# Altium schematic sheet BM_LTC2943.SchDoc
size A4; SheetNumber: 6; SheetTotal: 10
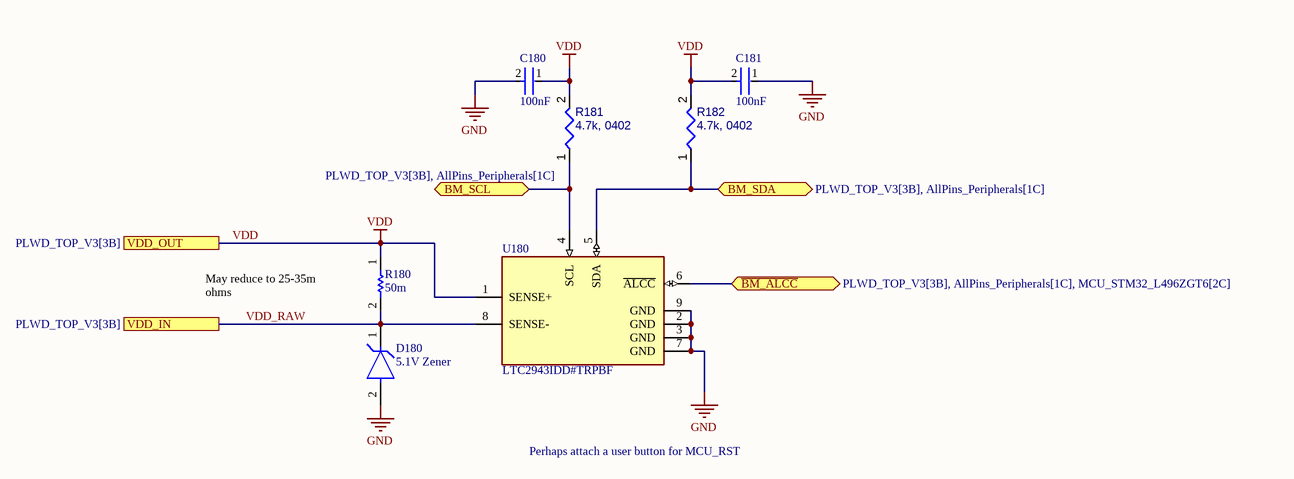
[diagram p0: BM_LTC2943.SchDoc]

## Parts
C180  100nF  [FP-GRM15-MFG]
C181  100nF  [FP-GRM15-MFG]
D180  5.1V Zener  [FP-SOD123-MFG]
R180  50m  [RESC1608X55X30NL15T15]
R181  4.7k, 0402  [RESC0402(1005)_L]
R182  4.7k, 0402  [RESC0402(1005)_L]
U180  LTC2943IDD#TRPBF  [FP-DD-8-05-08-1698-IPC_B]

## Ports
BM_SCL (bidir, see PLWD_TOP_V3[3B], AllPins_Peripherals[1C]), BM_SDA (bidir, see PLWD_TOP_V3[3B], AllPins_Peripherals[1C]), VDD_IN (see PLWD_TOP_V3[3B]), VDD_OUT (see PLWD_TOP_V3[3B]), ~{BM_ALCC} (bidir, see PLWD_TOP_V3[3B], AllPins_Peripherals[1C], MCU_STM32_L496ZGT6[2C])

## Nets
GND: C180.2 C181.1 D180.2(A) U180.2(GND) U180.3(GND) U180.7(GND) U180.9(GND)
VDD: C180.1 C181.2 R180.1 R181.2 R182.2 U180.1(SENSE+) ; port VDD_OUT
~{BM_ALCC}: U180.6(~{ALCC}) ; port ~{BM_ALCC}
BM_SCL: R181.1 U180.4(SCL) ; port BM_SCL
BM_SDA: R182.1 U180.5(SDA) ; port BM_SDA
VDD_RAW: D180.1(C) R180.2 U180.8(SENSE-) ; port VDD_IN

## Notes on the sheet
- May reduce to 25-35m ohms
- Perhaps attach a user button for MCU_RST

## Library data of the parts
C180 C181 = CMP-2100-03641-2: CAP CER 0.1UF 16V X7R 0402; Manufacturer Part Number: GRM155R71C104KA88D; Manufacturer: Murata; Standoff Height: 0mm; Tolerance: 10%; Voltage Rating: 16Vdc; Material: Ceramic; Capacitance: 0.10μF; Value: 0.10μF; RoHS: TRUE; Temperature Characteristic: X7R; Octopart: https://octopart.com/grm155r71c104ka88d-murata-196880; Digikey Description: CAP CER 0.1UF 16V X7R 0402; Device Class L3: Ceramic Capacitors; Height: 0.55mm; ComponentLink2Description: Datasheet; Temperature Range Low: -55°C; Ipc Land Pattern Name: CAPC10050X219; ComponentLink2URL: https://search.murata.co.jp/Ceramy/image/img/A01X/G101/ENG/GRM155R71H471KA01-01A.pdf; Device Class L1: Passive Components; Lead Free: yes; Category: Cap; Package: GRM15; Temperature: -55°C to +125°C; Device Class L2: Capacitors; Temperature Range High: +125°C; Mouser Description: 0402 0.1 uF 16V ±10 % Tolerance X7R SMT Multilayer Ceramic Capacitor
D180 = CMP-2000-05976-2: DIODE ZENER 5.1V 500MW SOD123; Manufacturer Part Number: BZT52C5V1-7-F; Manufacturer: Diodes Incorporated; Standoff Height: 0mm; Max Reverse Leakage Current: 2uA; Forward Current: 10mA; Power Dissipation: 370mW; Max Zener Voltage: 5.4V; Zener Impedance: 60Ω; Automotive Grade: NA; Max Junction Temp: +150°C; Device Class L3: Zener Diodes; ComponentLink2Description: Datasheet; Mouser Description: Zener Diodes 5.1V 500mW; Octopart: https://octopart.com/bzt52c5v1-7-f-diodes+inc.-326718; Package: SOD123; RoHS: TRUE; Nom Zener Voltage: 5.1V; Device Class L1: Discrete Semiconductors; Lead Free: Yes; Footprint Url: https://www.diodes.com/assets/Package-Files/SOD123.pdf; ComponentLink2URL: https://www.diodes.com/assets/Datasheets/ds18004.pdf; Digikey Description: DIODE ZENER 5.1V 500MW SOD123; Height: 1.45mm; Temperature Range Low: -65°C; Device Class L2: Diodes; Temperature: -65°C to +150°C; Automotive: No; Temperature Range High: +150°C; Category: Diode
R180 = CMP-2000-00867-1: Manufacturer: Panasonic; Part Number: ERJ-L03KF50MV
R181 R182 = CMP-009-00158-3: Chip Resistor, 4,7 kOhms, +/-1 %, 63 mW, -55 to 155 degC, 0402; Power: 63mW; Tolerance: 1%; Max Operating Temperature: 155°C; Pins: 2; Value: 4.7k; Min Operating Temperature: -55°C; Case/Package: 0402
U180 = CMP-09132-000025-1: IC BATT MONITOR MULTI-CHEM 8DFN; Interface: I2C; Case/Package: DFN; Packaging: Tape and Reel; Number of Pins: 8; Max Operating Temperature: 85°C; RoHS Compliant: Yes; Min Operating Temperature: -40°C